# Altium schematic sheet SDcard.SchDoc
size A; SheetNumber: 11; SheetTotal: 12
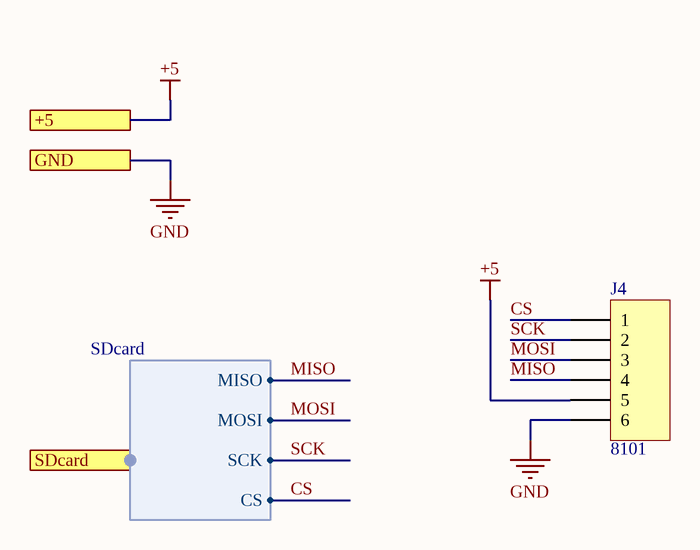
[diagram p0: SDcard.SchDoc]

## Parts
J4  Inflow: 8101  [HDR_THT_6F_2.54mm]  (hidden comment: 6)

## Ports
+5, GND, SDcard (harness SDcard)

## Harnesses
SDcard: MISO, MOSI, SCK, CS

## Nets
+5: J4.5 ; port +5
GND: J4.6 ; port GND
CS: J4.1 ; port SDcard.CS
MISO: J4.4 ; port SDcard.MISO
MOSI: J4.3 ; port SDcard.MOSI
SCK: J4.2 ; port SDcard.SCK

## Library data of the parts
J4 = Con_FPH_6x1_V_THT_2.54: Header, single row, 6 pin; Rating: Rating?; Validation: NT; Value: 6; Package: Package?; Type: Type?